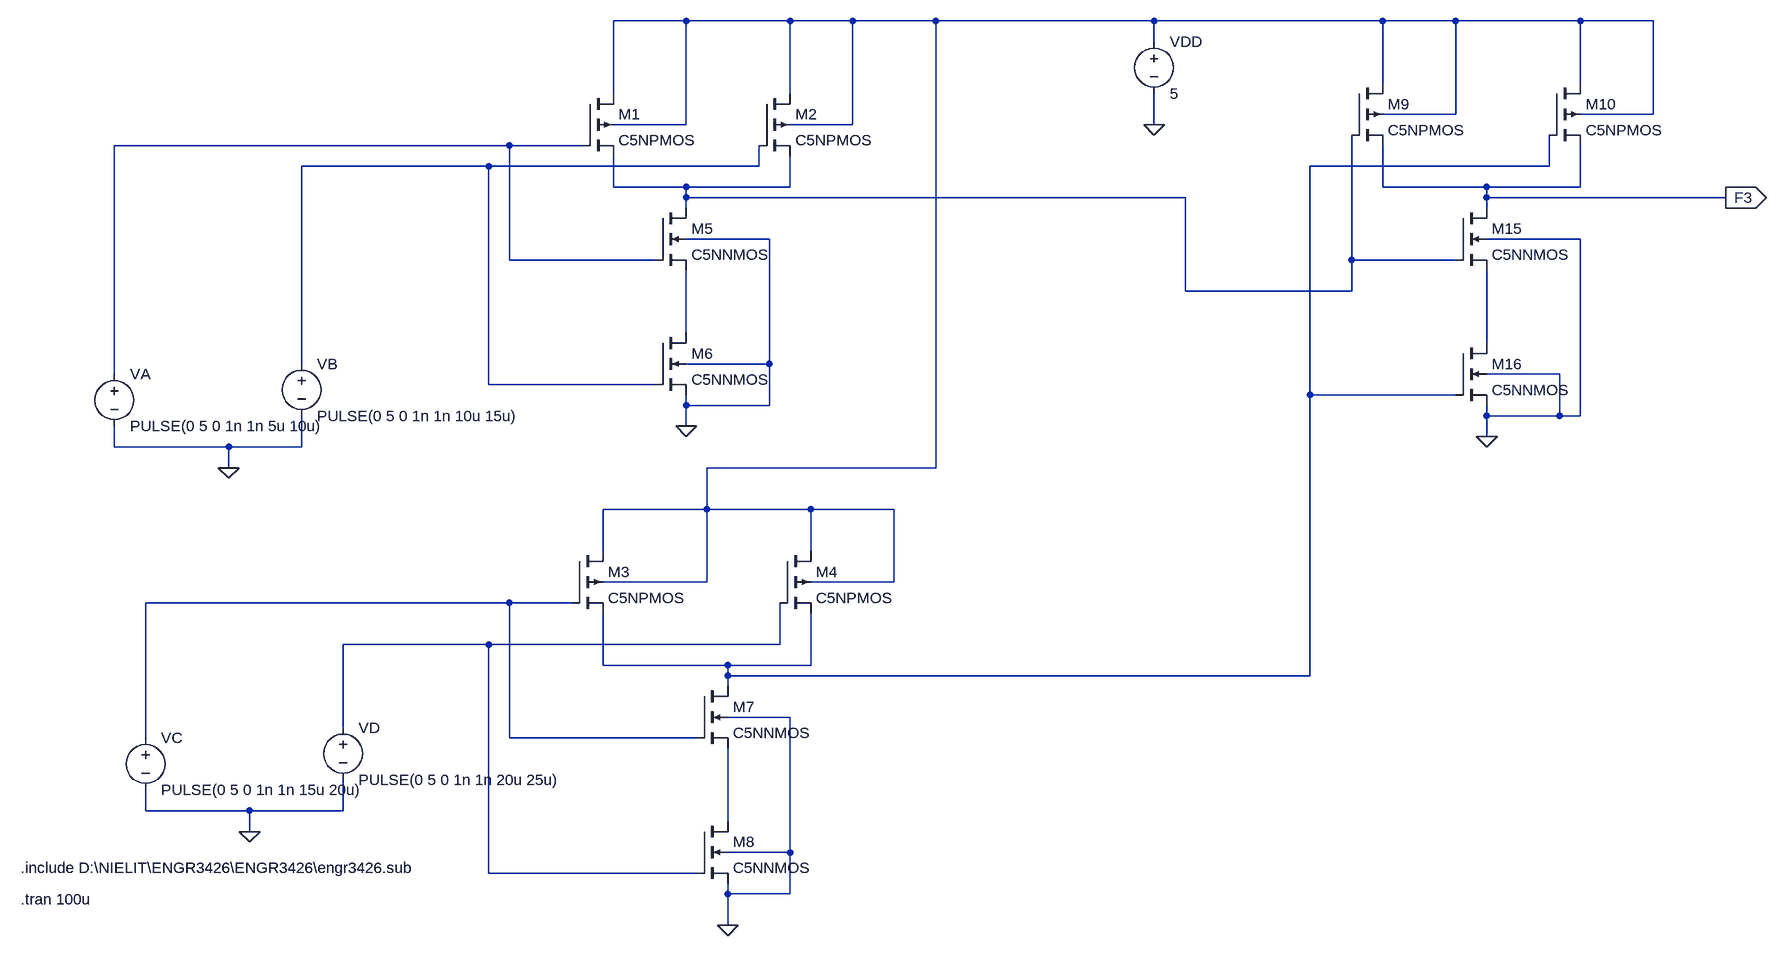
[diagram p0: schematic F3.asc]
F3.asc, the LTspice schematic file:
Version 4
SHEET 1 1864 1128
WIRE 176 -304 64 -304
WIRE 336 -304 176 -304
WIRE 432 -304 336 -304
WIRE 560 -304 432 -304
WIRE 896 -304 560 -304
WIRE 1248 -304 896 -304
WIRE 1360 -304 1248 -304
WIRE 1552 -304 1360 -304
WIRE 1664 -304 1552 -304
WIRE 896 -272 896 -304
WIRE 1248 -208 1248 -304
WIRE 1552 -208 1552 -304
WIRE 64 -192 64 -304
WIRE 336 -192 336 -304
WIRE 1360 -160 1360 -304
WIRE 1360 -160 1248 -160
WIRE 1664 -160 1664 -304
WIRE 1664 -160 1552 -160
WIRE 176 -144 176 -304
WIRE 176 -144 64 -144
WIRE 432 -144 432 -304
WIRE 432 -144 336 -144
WIRE 896 -144 896 -192
WIRE -96 -112 -704 -112
WIRE 16 -112 -96 -112
WIRE -128 -80 -416 -80
WIRE 288 -80 288 -112
WIRE 288 -80 -128 -80
WIRE 1504 -80 1504 -128
WIRE 1504 -80 1136 -80
WIRE 64 -48 64 -96
WIRE 176 -48 64 -48
WIRE 336 -48 336 -96
WIRE 336 -48 176 -48
WIRE 1248 -48 1248 -112
WIRE 1408 -48 1248 -48
WIRE 1552 -48 1552 -112
WIRE 1552 -48 1408 -48
WIRE 176 -32 176 -48
WIRE 944 -32 176 -32
WIRE 1408 -32 1408 -48
WIRE 1776 -32 1408 -32
WIRE 176 -16 176 -32
WIRE 1408 -16 1408 -32
WIRE 304 32 176 32
WIRE 1552 32 1408 32
WIRE -96 64 -96 -112
WIRE 128 64 -96 64
WIRE 1200 64 1200 -128
WIRE 1360 64 1200 64
WIRE 944 112 944 -32
WIRE 1200 112 1200 64
WIRE 1200 112 944 112
WIRE 176 176 176 80
WIRE 1408 192 1408 80
WIRE -416 224 -416 -80
WIRE 304 224 304 32
WIRE 304 224 176 224
WIRE -704 240 -704 -112
WIRE 1520 240 1408 240
WIRE -128 256 -128 -80
WIRE 128 256 -128 256
WIRE 1136 272 1136 -80
WIRE 1360 272 1136 272
WIRE 176 288 176 272
WIRE 304 288 304 224
WIRE 304 288 176 288
WIRE 1408 304 1408 288
WIRE 1520 304 1520 240
WIRE 1520 304 1408 304
WIRE 1552 304 1552 32
WIRE 1552 304 1520 304
WIRE 176 320 176 288
WIRE 1408 336 1408 304
WIRE -704 352 -704 320
WIRE -528 352 -704 352
WIRE -416 352 -416 304
WIRE -416 352 -528 352
WIRE -528 384 -528 352
WIRE 560 384 560 -304
WIRE 560 384 208 384
WIRE 208 448 208 384
WIRE 208 448 48 448
WIRE 368 448 208 448
WIRE 496 448 368 448
WIRE 48 512 48 448
WIRE 368 512 368 448
WIRE 208 560 208 448
WIRE 208 560 48 560
WIRE 496 560 496 448
WIRE 496 560 368 560
WIRE -96 592 -656 592
WIRE 0 592 -96 592
WIRE -128 656 -352 656
WIRE 320 656 320 592
WIRE 320 656 -128 656
WIRE 48 688 48 608
WIRE 240 688 48 688
WIRE 368 688 368 608
WIRE 368 688 240 688
WIRE 240 704 240 688
WIRE 1136 704 1136 272
WIRE 1136 704 240 704
WIRE 240 720 240 704
WIRE 336 768 240 768
WIRE -352 784 -352 656
WIRE -656 800 -656 592
WIRE -96 800 -96 592
WIRE 192 800 -96 800
WIRE -656 912 -656 880
WIRE -496 912 -656 912
WIRE -352 912 -352 864
WIRE -352 912 -496 912
WIRE 240 928 240 816
WIRE -496 944 -496 912
WIRE 336 976 336 768
WIRE 336 976 240 976
WIRE -128 1008 -128 656
WIRE 192 1008 -128 1008
WIRE 240 1040 240 1024
WIRE 336 1040 336 976
WIRE 336 1040 240 1040
WIRE 240 1088 240 1040
FLAG 176 320 0
FLAG 240 1088 0
FLAG -496 944 0
FLAG -528 384 0
FLAG 896 -144 0
FLAG 1408 336 0
FLAG 1776 -32 F3
IOPIN 1776 -32 Out
SYMBOL pmos4 16 -192 R0
SYMATTR InstName M1
SYMATTR Value C5NPMOS
SYMATTR Value2 l=0.6u w=7.2u
SYMBOL pmos4 288 -192 R0
SYMATTR InstName M2
SYMATTR Value C5NPMOS
SYMATTR Value2 l=0.6u w=7.2u
SYMBOL pmos4 0 512 R0
SYMATTR InstName M3
SYMATTR Value C5NPMOS
SYMATTR Value2 l=0.6u w=7.2u
SYMBOL pmos4 320 512 R0
SYMATTR InstName M4
SYMATTR Value C5NPMOS
SYMATTR Value2 l=0.6u w=7.2u
SYMBOL voltage 896 -288 R0
SYMATTR InstName VDD
SYMATTR Value 5
SYMBOL voltage -704 224 R0
WINDOW 123 0 0 Left 0
WINDOW 39 0 0 Left 0
SYMATTR InstName VA
SYMATTR Value PULSE(0 5 0 1n 1n 5u 10u)
SYMBOL voltage -416 208 R0
WINDOW 123 0 0 Left 0
WINDOW 39 0 0 Left 0
SYMATTR InstName VB
SYMATTR Value PULSE(0 5 0 1n 1n 10u 15u)
SYMBOL voltage -656 784 R0
WINDOW 123 0 0 Left 0
WINDOW 39 0 0 Left 0
SYMATTR InstName VC
SYMATTR Value PULSE(0 5 0 1n 1n 15u 20u)
SYMBOL voltage -352 768 R0
WINDOW 123 0 0 Left 0
WINDOW 39 0 0 Left 0
SYMATTR InstName VD
SYMATTR Value PULSE(0 5 0 1n 1n 20u 25u)
SYMBOL nmos4 128 -16 R0
SYMATTR InstName M5
SYMATTR Value C5NNMOS
SYMATTR Value2 l=0.6u w=3.6u
SYMBOL nmos4 128 176 R0
SYMATTR InstName M6
SYMATTR Value C5NNMOS
SYMATTR Value2 l=0.6u w=3.6u
SYMBOL nmos4 192 720 R0
SYMATTR InstName M7
SYMATTR Value C5NNMOS
SYMATTR Value2 l=0.6u w=3.6u
SYMBOL nmos4 192 928 R0
SYMATTR InstName M8
SYMATTR Value C5NNMOS
SYMATTR Value2 l=0.6u w=3.6u
SYMBOL pmos4 1200 -208 R0
SYMATTR InstName M9
SYMATTR Value C5NPMOS
SYMATTR Value2 l=0.6u w=7.2u
SYMBOL pmos4 1504 -208 R0
SYMATTR InstName M10
SYMATTR Value C5NPMOS
SYMATTR Value2 l=0.6u w=7.2u
SYMBOL nmos4 1360 -16 R0
SYMATTR InstName M15
SYMATTR Value C5NNMOS
SYMATTR Value2 l=0.6u w=3.6u
SYMBOL nmos4 1360 192 R0
SYMATTR InstName M16
SYMATTR Value C5NNMOS
SYMATTR Value2 l=0.6u w=3.6u
TEXT -848 1000 Left 2 !.include D:\\NIELIT\\ENGR3426\\ENGR3426\\engr3426.sub
TEXT -848 1048 Left 2 !.tran 100u

The netlist it stands for:
* F3.asc
M1 N001 N002 N005 N001 C5NPMOS l=0.6u w=7.2u
M2 N001 N003 N005 N001 C5NPMOS l=0.6u w=7.2u
M3 N001 N008 N004 N001 C5NPMOS l=0.6u w=7.2u
M4 N001 N009 N004 N001 C5NPMOS l=0.6u w=7.2u
VDD N001 0 5
VA N002 0 PULSE(0 5 0 1n 1n 5u 10u)
VB N003 0 PULSE(0 5 0 1n 1n 10u 15u)
VC N008 0 PULSE(0 5 0 1n 1n 15u 20u)
VD N009 0 PULSE(0 5 0 1n 1n 20u 25u)
M5 N005 N002 N006 0 C5NNMOS l=0.6u w=3.6u
M6 N006 N003 0 0 C5NNMOS l=0.6u w=3.6u
M7 N004 N008 N010 0 C5NNMOS l=0.6u w=3.6u
M8 N010 N009 0 0 C5NNMOS l=0.6u w=3.6u
M9 N001 N005 F3 N001 C5NPMOS l=0.6u w=7.2u
M10 N001 N004 F3 N001 C5NPMOS l=0.6u w=7.2u
M15 F3 N005 N007 0 C5NNMOS l=0.6u w=3.6u
M16 N007 N004 0 0 C5NNMOS l=0.6u w=3.6u
.model NMOS NMOS
.model PMOS PMOS
.lib standard.mos
.include D:\NIELIT\ENGR3426\ENGR3426\engr3426.sub
.tran 100u
.backanno
.end